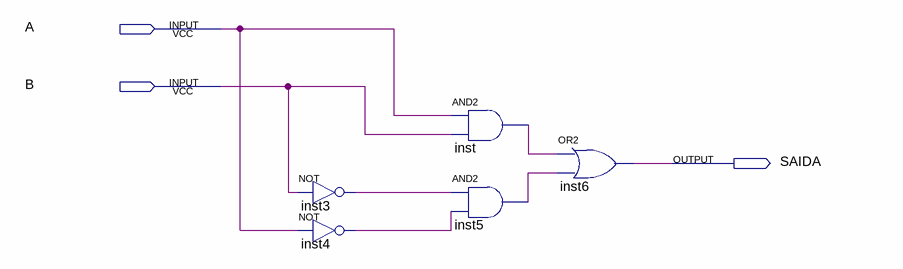
[diagram p0: schematic sheet]
// Quartus schematic comparador.bdf as structural Verilog: 5 symbols, 3 pins
module comparador (
  input  A,
  input  B,
  output SAIDA
);

  wire inst3_out, inst4_out, inst5_out, inst_out;

  not inst3 (inst3_out, B);
  not inst4 (inst4_out, A);
  and inst (inst_out, A, B);
  and inst5 (inst5_out, inst3_out, inst4_out);
  or inst6 (SAIDA, inst_out, inst5_out);
endmodule
